# Altium schematic sheet MDBU003_Schematic.SchDoc
size 431 x 279 mm; Date: Not shown in title block; ApprovedBy: Not shown in title block; CheckedBy: Not shown in title block; Author: Not shown in title block; CompanyName: Not shown in title block; Engineer: Not shown in title block; Organization: Not shown in title block; Address1: Not shown in title block; Address2: Not shown in title block; Address3: Not shown in title block; Address4: Not shown in title block; DocumentNumber: 1; Revision: Use project parameter SCH_Rev; SheetNumber: 2; SheetTotal: 2; PageSetup: Record=PageOptions|CenterHorizontal=True|CenterVertical=True|PrintScale=1.00|XCorrection=1.00|YCorrection=1.00|PrintKind=0|BorderSize=5000000|LeftOffset=0|BottomOffset=0|Orientation=2|PaperLength=1000|PaperWidth=1000|Scale=100|PaperSource=15|PrintQuality=600|MediaType=1|DitherType=10|PaperKind=Letter|PrintScaleMode=1; CurrentTime: Not shown in title block; CurrentDate: Not shown in title block; Time: Not shown in title block; DocumentFullPathAndName: Not shown in title block; DocumentName: Not shown in title block; ModifiedDate: Not shown in title block; ImagePath: Not shown in title block
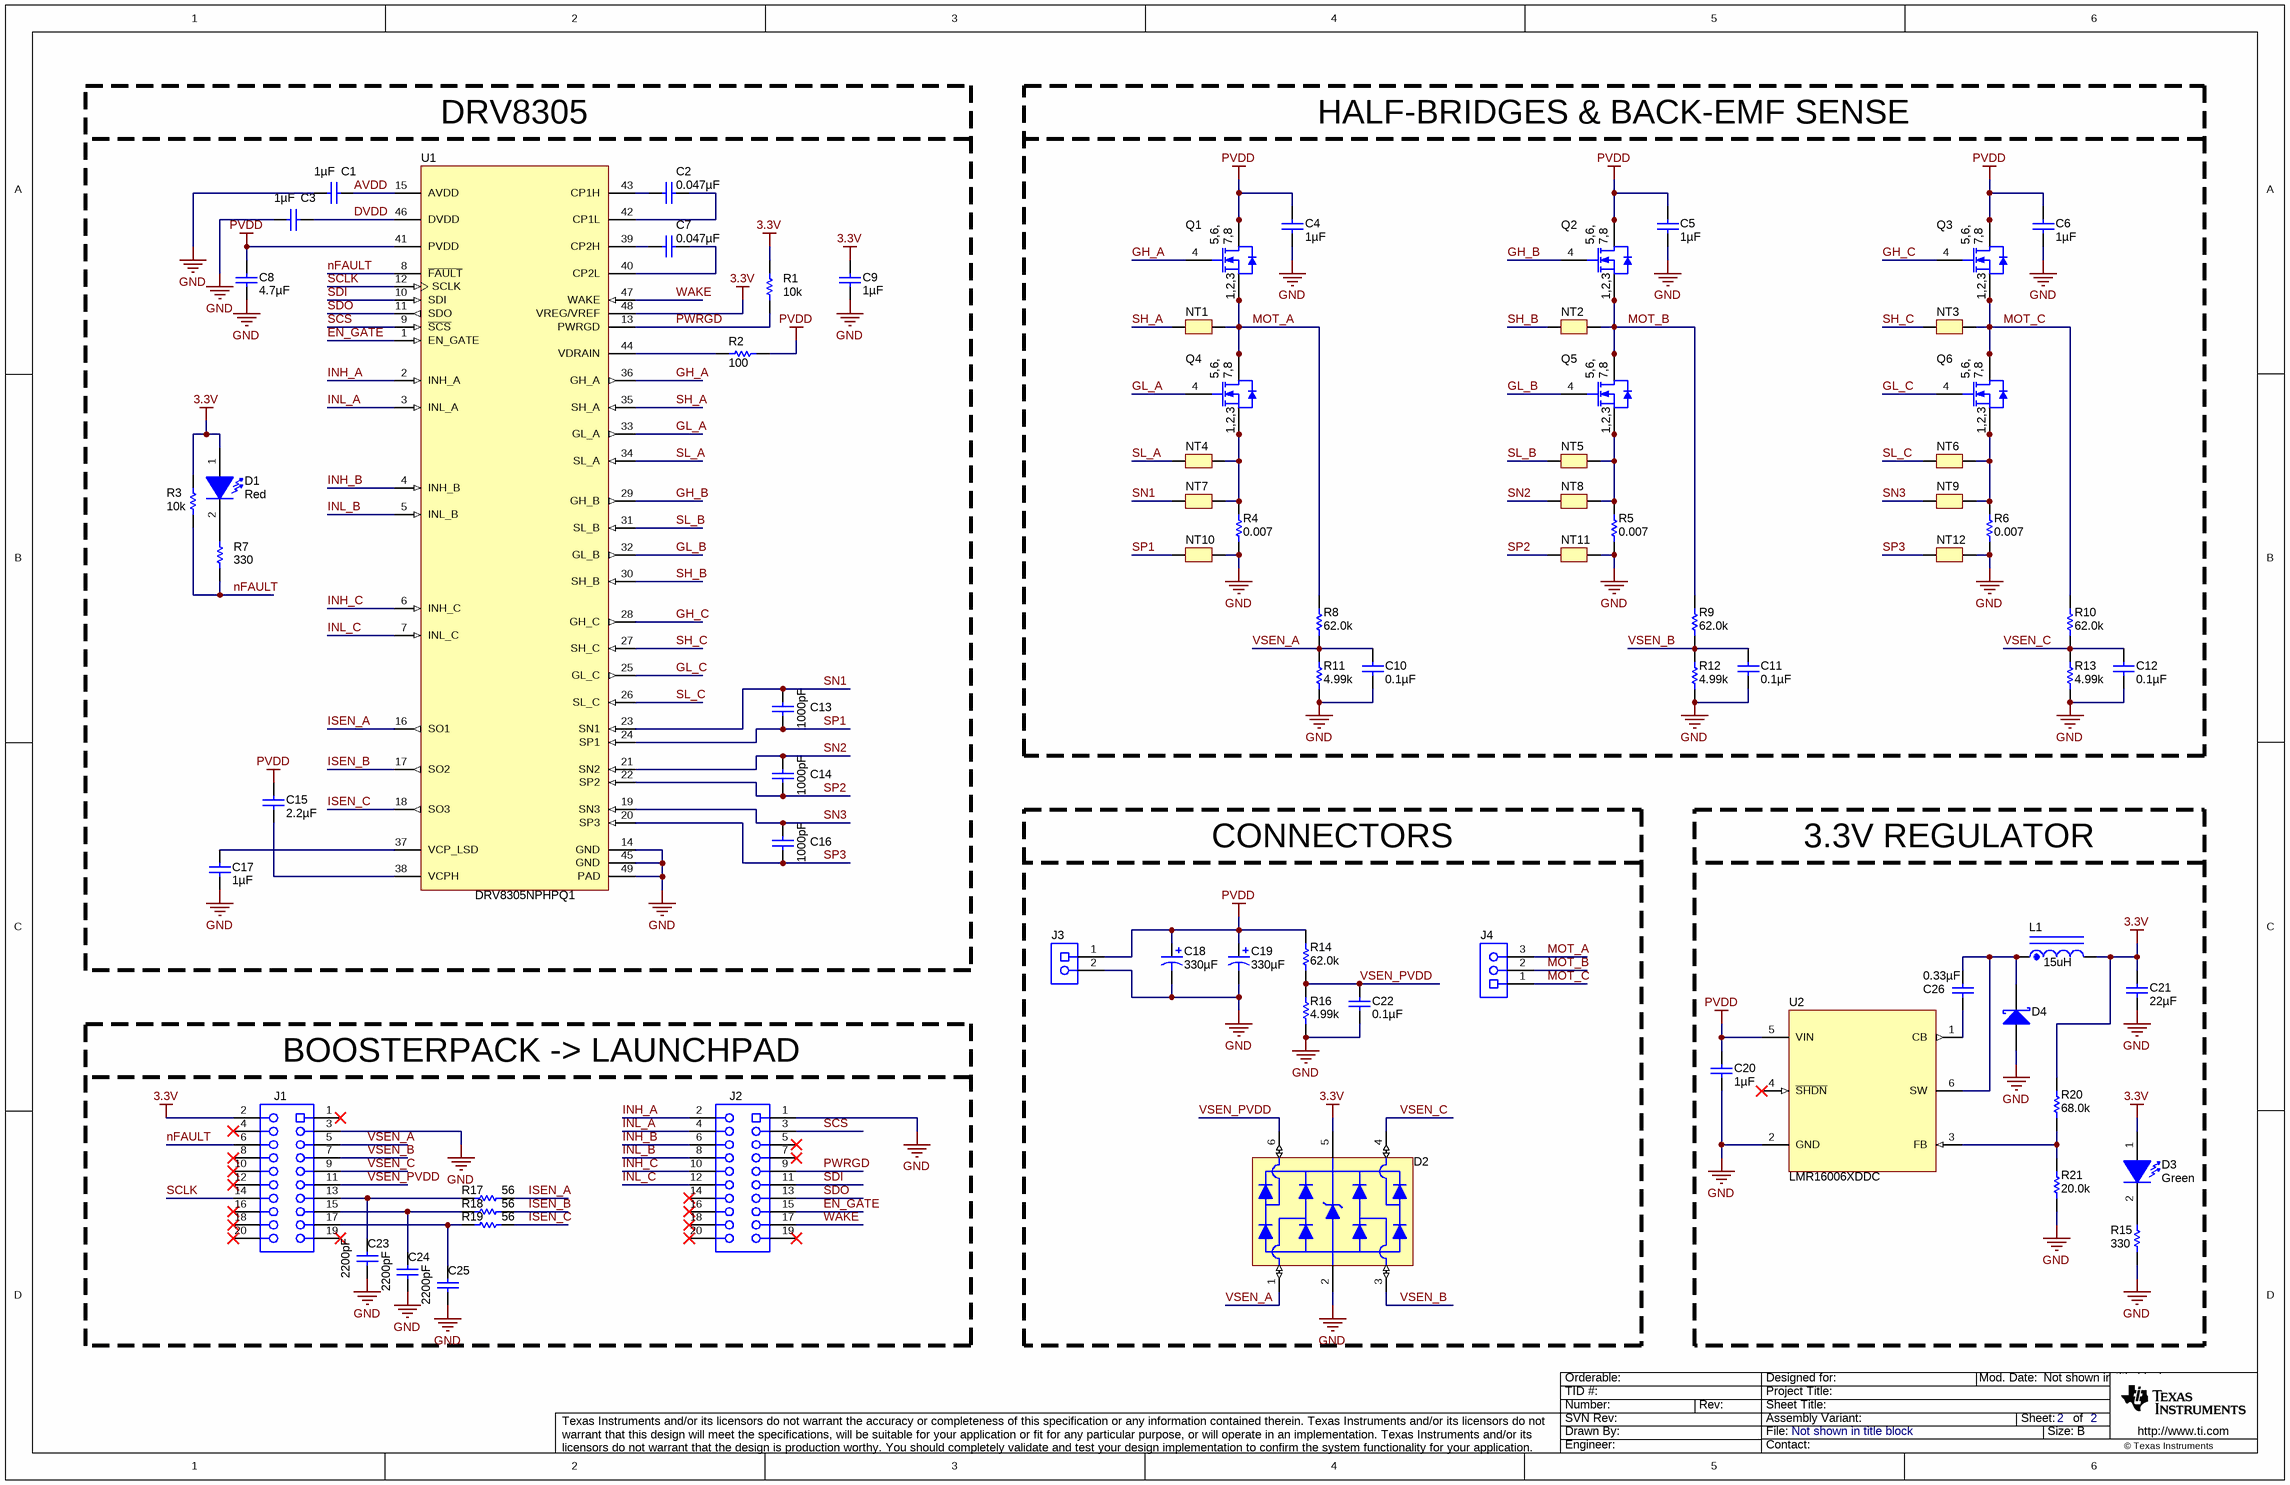
[diagram p0: MDBU003_Schematic.SchDoc]

## Parts
C1  ValueDisplayed: 1µF  [0603L]  (hidden comment: C1608X7R1C105K)
C2  ValueDisplayed: 0.047µF  [0603L]  (hidden comment: C0603C473K1RACTU)
C3  ValueDisplayed: 1µF  [0603L]  (hidden comment: C1608X7R1C105K)
C4  ValueDisplayed: 1µF  [0603L]  (hidden comment: UMK107AB7105KA-T)
C5  ValueDisplayed: 1µF  [0603L]  (hidden comment: UMK107AB7105KA-T)
C6  ValueDisplayed: 1µF  [0603L]  (hidden comment: UMK107AB7105KA-T)
C7  ValueDisplayed: 0.047µF  [0603L]  (hidden comment: C0603C473K1RACTU)
C8  ValueDisplayed: 4.7µF  [1206L]  (hidden comment: GRM31CR71H475KA12L)
C9  ValueDisplayed: 1µF  [0603L]  (hidden comment: C1608X7R1C105K)
C10  ValueDisplayed: 0.1µF  [0603L]  (hidden comment: C0603C104J4RACTU)
C11  ValueDisplayed: 0.1µF  [0603L]  (hidden comment: C0603C104J4RACTU)
C12  ValueDisplayed: 0.1µF  [0603L]  (hidden comment: C0603C104J4RACTU)
C13  ValueDisplayed: 1000pF  [0603L]  (hidden comment: GRM188R71C102KA01D)
C14  ValueDisplayed: 1000pF  [0603L]  (hidden comment: GRM188R71C102KA01D)
C15  ValueDisplayed: 2.2µF  [1210L]  (hidden comment: GRM32ER72A225KA35L)
C16  ValueDisplayed: 1000pF  [0603L]  (hidden comment: GRM188R71C102KA01D)
C17  ValueDisplayed: 1µF  [0603L]  (hidden comment: C1608X7R1C105K)
C18  ValueDisplayed: 330µF  [SM_RADIAL_G]  (hidden comment: EEE-FT1H331AP)
C19  ValueDisplayed: 330µF  [SM_RADIAL_G]  (hidden comment: EEE-FT1H331AP)
C20  ValueDisplayed: 1µF  [0603L]  (hidden comment: UMK107AB7105KA-T)
C21  ValueDisplayed: 22µF  [1206L]  (hidden comment: GRM31CR71A226KE15L)
C22  ValueDisplayed: 0.1µF  [0603L]  (hidden comment: C0603C104J4RACTU)
C23  ValueDisplayed: 2200pF  [0603L]  (hidden comment: GRM188R71C222KA01D)
C24  ValueDisplayed: 2200pF  [0603L]  (hidden comment: GRM188R71C222KA01D)
C25  ValueDisplayed: 2200pF  [0603L]  (hidden comment: GRM188R71C222KA01D)
C26  ValueDisplayed: 0.33µF  [0603L]  (hidden comment: GRM188R71C334KA01D)
D1  value Red  [LED_LTST-C170]  (hidden comment: LTST-C170KRKT)
D2  NUP4201MR6T1G  [TSOP-6]  (value not drawn)
D3  value Green  [LED_LTST-C171]  (hidden comment: LTST-C171GKT)
D4  MBR1H100SFT3G  [SOD-123FL]  (value not drawn)
J1  CRD-081413-A-G  [Major_CRD-081413-A-x]  (value not drawn)
J2  CRD-081413-A-G  [Major_CRD-081413-A-x]  (value not drawn)
J3  691 101 710 002  [Wurth_691101710002]  (value not drawn)
J4  691 101 710 003  [Wurth_691101710003]  (value not drawn)
L1  value 15uH  [SD53]  (hidden comment: SD53-150-R)
NT1  Net-Tie  [Net-Tie_10mil]  (value not drawn)  (net tie, no BOM)
NT2  Net-Tie  [Net-Tie_10mil]  (value not drawn)  (net tie, no BOM)
NT3  Net-Tie  [Net-Tie_10mil]  (value not drawn)  (net tie, no BOM)
NT4  Net-Tie  [Net-Tie_10mil]  (value not drawn)  (net tie, no BOM)
NT5  Net-Tie  [Net-Tie_10mil]  (value not drawn)  (net tie, no BOM)
NT6  Net-Tie  [Net-Tie_10mil]  (value not drawn)  (net tie, no BOM)
NT7  Net-Tie  [Net-Tie_10mil]  (value not drawn)  (net tie, no BOM)
NT8  Net-Tie  [Net-Tie_10mil]  (value not drawn)  (net tie, no BOM)
NT9  Net-Tie  [Net-Tie_10mil]  (value not drawn)  (net tie, no BOM)
NT10  Net-Tie  [Net-Tie_10mil]  (value not drawn)  (net tie, no BOM)
NT11  Net-Tie  [Net-Tie_10mil]  (value not drawn)  (net tie, no BOM)
NT12  Net-Tie  [Net-Tie_10mil]  (value not drawn)  (net tie, no BOM)
Q1  CSD18540Q5B  [TRANS_NexFET_Q5B]  (value not drawn)
Q2  CSD18540Q5B  [TRANS_NexFET_Q5B]  (value not drawn)
Q3  CSD18540Q5B  [TRANS_NexFET_Q5B]  (value not drawn)
Q4  CSD18540Q5B  [TRANS_NexFET_Q5B]  (value not drawn)
Q5  CSD18540Q5B  [TRANS_NexFET_Q5B]  (value not drawn)
Q6  CSD18540Q5B  [TRANS_NexFET_Q5B]  (value not drawn)
R1  value 10k  [0603L]  (hidden comment: CRCW060310K0JNEA)
R2  value 100  [0603L]  (hidden comment: CRCW0603100RJNEA)
R3  value 10k  [0603L]  (hidden comment: CRCW060310K0JNEA)
R4  ValueDisplayed: 0.007  [2512L]  (hidden comment: CRE2512-FZ-R007E-3)
R5  ValueDisplayed: 0.007  [2512L]  (hidden comment: CRE2512-FZ-R007E-3)
R6  ValueDisplayed: 0.007  [2512L]  (hidden comment: CRE2512-FZ-R007E-3)
R7  value 330  [0603L]  (hidden comment: CRCW0603330RJNEA)
R8  ValueDisplayed: 62.0k  [0603L]  (hidden comment: RC0603FR-0762KL)
R9  ValueDisplayed: 62.0k  [0603L]  (hidden comment: RC0603FR-0762KL)
R10  ValueDisplayed: 62.0k  [0603L]  (hidden comment: RC0603FR-0762KL)
R11  ValueDisplayed: 4.99k  [0603L]  (hidden comment: RC0603FR-074K99L)
R12  ValueDisplayed: 4.99k  [0603L]  (hidden comment: RC0603FR-074K99L)
R13  ValueDisplayed: 4.99k  [0603L]  (hidden comment: RC0603FR-074K99L)
R14  ValueDisplayed: 62.0k  [0603L]  (hidden comment: RC0603FR-0762KL)
R15  value 330  [0603L]  (hidden comment: CRCW0603330RJNEA)
R16  ValueDisplayed: 4.99k  [0603L]  (hidden comment: RC0603FR-074K99L)
R17  value 56  [0603L]  (hidden comment: CRCW060356R0JNEA)
R18  value 56  [0603L]  (hidden comment: CRCW060356R0JNEA)
R19  value 56  [0603L]  (hidden comment: CRCW060356R0JNEA)
R20  ValueDisplayed: 68.0k  [0603L]  (hidden comment: RC0603FR-0768KL)
R21  ValueDisplayed: 20.0k  [0603L]  (hidden comment: CRCW060320K0FKEA)
U1  DRV8305NPHPQ1  [PHP0048G_L]
U2  LMR16006XDDC  [DDC0006A_N]

## Blocks framed on the sheet
DRV8305: C1-C3 C7-C9 C13-C17 D1 R1-R3 R7 U1
HALF-BRIDGES & BACK-EMF SENSE: C4-C6 C10-C12 NT1-NT12 Q1-Q6 R4-R6 R8-R13
CONNECTORS: C18 C19 C22 D2 J3 J4 R14 R16
3.3V REGULATOR: C20 C21 C26 D3 D4 L1 R15 R20 R21 U2
BOOSTERPACK -> LAUNCHPAD: C23-C25 J1 J2 R17-R19

## Nets
3.3V: C9.2 C21.1 D1.1(A) D2.5(VP) D3.1(A) J1.2 L1.2 R1.2 R3.2 R20.2 U1.48(VREG/VREF)
GND: C1.1 C3.1 C4.2 C5.2 C6.2 C8.1 C9.1 C10.2 C11.2 C12.2 C17.2 C18.2(-) C19.2(-) C20.2 C21.2 C22.2 C23.2 C24.2 C25.2 D2.2(VN) D4.2(A) J1.3 J2.1 J3.2 NT10.2 NT11.2 NT12.2 R4.1 R5.1 R6.1 R11.1 R12.1 R13.1 R15.1 R16.1 R21.1 U1.14(GND) U1.45(GND) U1.49(PAD) U2.2(GND)
PVDD: C4.1 C5.1 C6.1 C8.2 C15.1 C18.1(+) C19.1(+) C20.1 J3.1 Q1.5(D) Q1.6(D) Q1.7(D) Q1.8(D) Q2.5(D) Q2.6(D) Q2.7(D) Q2.8(D) Q3.5(D) Q3.6(D) Q3.7(D) Q3.8(D) R2.2 R14.2 U1.41(PVDD) U2.5(VIN)
AVDD: C1.2 U1.15(AVDD)
DVDD: C3.2 U1.46(DVDD)
EN_GATE: J2.15 U1.1(EN_GATE)
GH_A: Q1.4(G) U1.36(GH_A)
GH_B: Q2.4(G) U1.29(GH_B)
GH_C: Q3.4(G) U1.28(GH_C)
GL_A: Q4.4(G) U1.33(GL_A)
GL_B: Q5.4(G) U1.32(GL_B)
GL_C: Q6.4(G) U1.25(GL_C)
INH_A: J2.2 U1.2(INH_A)
INH_B: J2.6 U1.4(INH_B)
INH_C: J2.10 U1.6(INH_C)
INL_A: J2.4 U1.3(INL_A)
INL_B: J2.8 U1.5(INL_B)
INL_C: J2.12 U1.7(INL_C)
ISEN_A: R17.2 U1.16(SO1)
ISEN_B: R18.2 U1.17(SO2)
ISEN_C: R19.2 U1.18(SO3)
MOT_A: J4.3 NT1.2 Q1.1(S) Q1.2(S) Q1.3(S) Q4.5(D) Q4.6(D) Q4.7(D) Q4.8(D) R8.2
MOT_B: J4.2 NT2.2 Q2.1(S) Q2.2(S) Q2.3(S) Q5.5(D) Q5.6(D) Q5.7(D) Q5.8(D) R9.2
MOT_C: J4.1 NT3.2 Q3.1(S) Q3.2(S) Q3.3(S) Q6.5(D) Q6.6(D) Q6.7(D) Q6.8(D) R10.2
nFAULT: J1.6 R3.1 R7.1 U1.8(~{FAULT})
PWRGD: J2.9 R1.1 U1.13(PWRGD)
SCLK: J1.14 U1.12(SCLK)
SCS: J2.3 U1.9(~{SCS})
SDI: J2.11 U1.10(SDI)
SDO: J2.13 U1.11(SDO)
SH_A: NT1.1 U1.35(SH_A)
SH_B: NT2.1 U1.30(SH_B)
SH_C: NT3.1 U1.27(SH_C)
SL_A: NT4.1 U1.34(SL_A)
SL_B: NT5.1 U1.31(SL_B)
SL_C: NT6.1 U1.26(SL_C)
SN1: C13.1 NT7.1 U1.23(SN1)
SN2: C14.1 NT8.1 U1.21(SN2)
SN3: C16.1 NT9.1 U1.19(SN3)
SP1: C13.2 NT10.1 U1.24(SP1)
SP2: C14.2 NT11.1 U1.22(SP2)
SP3: C16.2 NT12.1 U1.20(SP3)
VSEN_A: C10.1 D2.1(I/O) J1.5 R8.1 R11.2
VSEN_B: C11.1 D2.3(I/O) J1.7 R9.1 R12.2
VSEN_C: C12.1 D2.4(I/O) J1.9 R10.1 R13.2
VSEN_PVDD: C22.1 D2.6(I/O) J1.11 R14.1 R16.2
WAKE: J2.17 U1.47(WAKE)
NetC2_1: C2.1 U1.43(CP1H)
NetC2_2: C2.2 U1.42(CP1L)
NetC7_1: C7.1 U1.39(CP2H)
NetC7_2: C7.2 U1.40(CP2L)
NetC15_2: C15.2 U1.38(VCPH)
NetC17_1: C17.1 U1.37(VCP_LSD)
NetC23_1: C23.1 J1.13 R17.1
NetC24_1: C24.1 J1.15 R18.1
NetC25_1: C25.1 J1.17 R19.1
NetC26_1: C26.1 D4.1(K) L1.1 U2.6(SW)
NetC26_2: C26.2 U2.1(CB)
NetD1_2: D1.2(K) R7.2
NetD3_2: D3.2(K) R15.2
NetNT4_2: NT4.2 NT7.2 Q4.1(S) Q4.2(S) Q4.3(S) R4.2
NetNT5_2: NT5.2 NT8.2 Q5.1(S) Q5.2(S) Q5.3(S) R5.2
NetNT6_2: NT6.2 NT9.2 Q6.1(S) Q6.2(S) Q6.3(S) R6.2
NetR2_1: R2.1 U1.44(VDRAIN)
NetR20_1: R20.1 R21.2 U2.3(FB)

Not connected (* = marked no-connect by the designer): J1 1* 4* 8* 10* 12* 16* 18* 19* 20*; J2 5* 7* 14* 16* 18* 19* 20*; U2 4(~{SHDN})*

## Notes on the sheet
- Drawn By:
- SVN Rev:
- Number:
- TID #:
- Orderable:
- Rev:
- Sheet Title:
- File:
- Project Title:
- Designed for:
- Assembly Variant:
- Mod. Date:
- Sheet:
- Size:
- of
- B
- http://www.ti.com
- Texas Instruments and/or its licensors do not warrant the accuracy or completeness of this specification or any information contained therein. Texas Instruments and/or its licensors do not warrant that this design will meet the specifications, will be suitable for your application or fit for any particular purpose, or will operate in an implementation. Texas Instruments and/or its licensors do not warrant that the design is production worthy. You should completely validate and test your design implementation to confirm the system functionality for your application.
- Engineer:
- Contact:
- © Texas Instruments
- (in symbol CSD18540Q5B) 5,6,; 7,8; 1,2,3

## Library data of the parts
C1 C3 C9 C17 = C1608X7R1C105K: CAP, CERM, 1 µF, 16 V, +/- 10%, X7R, 0603; Manufacturer: TDK; Polarized: N; CompType: Capacitor; Value: 1uF; U/M: EA; Cap_F: 0.000001; Tolerance_%: 10; ESR_ohm: 0.0057; Value1: 0.0057 ohm; VDC_V: 16; Value2: 16V; TaMin_C: -55; TaMax_C: 125; Cap_Case: 0603; SymbolVersion: 2008-07-09; PartNumber: C1608X7R1C105K; PackageReference: 0603; RoHS: Y; MountType: SMT; Technology: Ceramic; TempCo: X7R; Published: 2008-06-19; Publisher: Texas Instruments; LatestRevisionDate: 2015-02-03; ComponentLink1Description: Datasheet link; ComponentLink1URL: http://www.tdk.co.jp/tefe02/e412_c.pdf; Supplier 1: Digi-Key; Supplier Part Number 1: 445-1604-1-ND; Supplier 2: Farnell; Supplier Part Number 2: 1907343
C2 C7 = GRM188R72A104KA35D: CAP, CERM, 0.047uF, 100V, +/-10%, X7R, 0603; Manufacturer: Kemet; Polarized: N; CompType: Capacitor; U/M: EA; Cap_F: 0.000000047; Tolerance_%: 10; Value1: Unknown; VDC_V: 100; TaMin_C: -55; TaMax_C: 125; Cap_Case: 0603; SymbolVersion: 2008-07-09; Value: 0.047uF; PartNumber: C0603C473K1RACTU; PackageReference: 0603; RoHS: Y; Value2: 100V; MountType: SMT; Technology: Ceramic; TempCo: X7R; Published: 2008-06-19; Publisher: Texas Instruments; LatestRevisionDate: 2013-09-06; ComponentLink1Description: Datasheet link; Supplier 1: Digi-Key; Supplier Part Number 1: 399-9096-1-ND
C4-C6 C20 = UMK107AB7105KA-T: CAP, CERM, 1 µF, 50 V, +/- 10%, X7R, 0603; Manufacturer: Taiyo Yuden; Polarized: N; CompType: Capacitor; Value: 1uF; U/M: EA; Cap_F: 0.000001; Tolerance_%: 10; Value1: Unknown; VDC_V: 50; Value2: 50V; TaMin_C: -55; TaMax_C: 125; Cap_Case: 0603; SymbolVersion: 2008-07-09; PartNumber: UMK107AB7105KA-T; PackageReference: 0603; RoHS: Y; MountType: SMT; Technology: Ceramic; TempCo: X7R; Published: 2008-06-19; Publisher: Texas Instruments; ComponentLink1Description: Datasheet link; ComponentLink1URL: http://www.yuden.co.jp/ut/product/category/capacitor/UMK107AB7105KA-T.pdf; Supplier 1: Digi-Key; Supplier Part Number 1: 587-3247-1-ND; Supplier 2: Mouser; Supplier Part Number 2: 963-UMK107AB7105KA-T; Supplier 3: Newark; Supplier Part Number 3: 45W1781
  C4-C6: LatestRevisionDate: 2015-01-29
  C20: LatestRevisionDate: 2015-02-10
C8 = GRM31CR71H475KA12L: CAP, CERM, 4.7 µF, 50 V, +/- 10%, X7R, 1206; Manufacturer: MuRata; Polarized: N; CompType: Capacitor; Value: 4.7uF; U/M: EA; Cap_F: 0.0000047; Tolerance_%: 10; Value1: Unknown; VDC_V: 50; Value2: 50V; TaMin_C: -55; TaMax_C: 125; Cap_Case: 2220; SymbolVersion: 2008-07-09; PartNumber: GRM31CR71H475KA12L; PackageReference: 1206; RoHS: Y; MountType: SMT; Technology: Ceramic; TempCo: X7R; Published: 2008-06-19; Publisher: Texas Instruments; LatestRevisionDate: 2015-02-03; ComponentLink1Description: Datasheet link; ComponentLink1URL: http://search.murata.co.jp/Ceramy/PnsearchViewAction.do?HnOFG=ON&HnNFG=ON&SEL_CNT=50&sLang=en&sKey=GRM31CR71H475KA12L&x=9&y=9&search=startwith; Supplier 1: Mouser; Supplier Part Number 1: 81-GRM31CR71H475KA2L; Supplier 2: Farnell; Supplier Part Number 2: 1735545; Supplier 3: Newark; Supplier Part Number 3: 24R6347
C10-C12 C22 = C0603C104J4RACTU: CAP, CERM, 0.1 µF, 16 V, +/- 5%, X7R, 0603; Manufacturer: Kemet; Polarized: N; CompType: Capacitor; Value: 0.1uF; U/M: EA; Cap_F: 0.0000001; Tolerance_%: 5; Value1: Unknown; VDC_V: 16; Value2: 16V; TaMin_C: -55; TaMax_C: 125; Cap_Case: 0603; SymbolVersion: 2008-07-09; PartNumber: C0603C104J4RACTU; PackageReference: 0603; RoHS: Y; MountType: SMT; Technology: Ceramic; TempCo: X7R; Published: 2008-06-19; Publisher: Texas Instruments; LatestRevisionDate: 2015-01-29; ComponentLink1Description: Datasheet link; ComponentLink1URL: http://www.kemet.com/kemet/web/homepage/kechome.nsf/vapubfiles/F3102_Y5V.pdf/$file/F3102_Y5V.pdf; Supplier 1: Digi-Key; Supplier Part Number 1: 399-1097-1-ND; Supplier 2: Mouser; Supplier Part Number 2: 80-C0603C104J4R; Supplier 3: Farnell; Supplier Part Number 3: 1650834
C13 C14 C16 = GRM188R71C102KA01D: CAP, CERM, 1000pF, 16V, +/-10%, X7R, 0603; Manufacturer: MuRata; Polarized: N; CompType: Capacitor; U/M: EA; Cap_F: 0.000000001; Tolerance_%: 10; Value1: Unknown; VDC_V: 16; TaMin_C: -55; TaMax_C: 125; Cap_Case: 0603; SymbolVersion: 2008-07-09; Value: 1000pF; PartNumber: GRM188R71C102KA01D; PackageReference: 0603; RoHS: Y; Value2: 16V; MountType: SMT; Technology: Ceramic; TempCo: X7R; Published: 2008-06-19; Publisher: Texas Instruments; LatestRevisionDate: 2014-07-08; ComponentLink1Description: Datasheet link; ComponentLink1URL: http://search.murata.co.jp/Ceramy/PnsearchViewAction.do?HnOFG=ON&HnNFG=ON&SEL_CNT=50&sLang=en&sKey=GRM188R71C102KA01D&x=9&y=9&search=startwith; Supplier 1: Digi-Key; Supplier Part Number 1: GRM188R71C102KA01D-ND; Supplier 2: Mouser; Supplier Part Number 2: 81-GRM188R71C102KA1D
C15 = GRM32ER72A225KA35L: CAP, CERM, 2.2 µF, 100 V, +/- 10%, X7R, 1210; Manufacturer: MuRata; Polarized: N; CompType: Capacitor; Value: 2.2uF; U/M: EA; Cap_F: 0.0000022; Tolerance_%: 10; ESR_ohm: 0.007; Value1: 0.007 ohm; VDC_V: 100; Value2: 100V; IRMS_A: 4.4; TaMin_C: -55; TaMax_C: 125; Cap_Case: 1210; SymbolVersion: 2008-07-09; PartNumber: GRM32ER72A225KA35L; PackageReference: 1210; RoHS: Y; MountType: SMT; Technology: Ceramic; TempCo: X7R; Published: 2008-06-19; Publisher: Texas Instruments; LatestRevisionDate: 2015-02-03; ComponentLink1Description: Datasheet link; ComponentLink1URL: http://search.murata.co.jp/Ceramy/PnsearchViewAction.do?HnOFG=ON&HnNFG=ON&SEL_CNT=50&sLang=en&sKey=GRM32ER72A225KA35L&x=9&y=9&search=startwith; Supplier 1: Digi-Key; Supplier Part Number 1: 490-3385-1-ND; Supplier 2: Mouser; Supplier Part Number 2: 81-GRM32ER72A225KA35; Supplier 3: Farnell; Supplier Part Number 3: 1735547
C18 C19 = EEE-FC1H221P: CAP, AL, 330 µF, 50 V, +/- 20%, 0.3 ohm, SMD; Manufacturer: Panasonic; Polarized: Y; CompType: Capacitor; Value: 330uF; U/M: EA; Cap_F: 0.00033; Tolerance_%: 20; Value1: 0.3 ohm; VDC_V: 50; Value2: 50V; ESR_ohm: 0.3; IRMS_A: 0.5; TaMin_C: -40; TaMax_C: 105; Cap_Case: G; SymbolVersion: 2008-07-09; PartNumber: EEE-FT1H331AP; PackageReference: SMT Radial G; RoHS: Y; MountType: SMT; Technology: AL; Series: FC; Publisher: Texas Instruments; LatestRevisionDate: 2015-02-03; Supplier 1: Digi-Key; Supplier Part Number 1: PCE5026CT-ND
C21 = GRM31CR71A226KE15L: CAP, CERM, 22 µF, 10 V, +/- 10%, X7R, 1206; Manufacturer: MuRata; Polarized: N; CompType: Capacitor; Value: 22uF; U/M: EA; Cap_F: 0.000022; Tolerance_%: 10; Value1: Unknown; Value2: 10V; TaMin_C: -55; TaMax_C: 125; Cap_Case: 1206; SymbolVersion: 2008-07-09; PartNumber: GRM31CR71A226KE15L; PackageReference: 1206; RoHS: Y; VDC_V: 10; MountType: SMT; Technology: Ceramic; TempCo: X7R; Published: 2008-06-19; Publisher: Texas Instruments; LatestRevisionDate: 2015-02-10; ComponentLink1Description: Datasheet link; ComponentLink1URL: http://search.murata.co.jp/Ceramy/PnsearchViewAction.do?HnOFG=ON&HnNFG=ON&SEL_CNT=50&sLang=en&sKey=GRM31CR71A226KE15L&x=9&y=9&search=startwith; Supplier 1: Digi-Key; Supplier Part Number 1: 490-5309-1-ND; Supplier 2: Mouser; Supplier Part Number 2: 81-GRM31CR71A226K15L; Supplier 3: Farnell; Supplier Part Number 3: 1797016
C23-C25 = GRM188R71C222KA01D: CAP, CERM, 2200pF, 16V, +/-10%, X7R, 0603; Manufacturer: MuRata; Polarized: N; CompType: Capacitor; U/M: EA; Cap_F: 0.0000000022; Tolerance_%: 10; Value1: Unknown; VDC_V: 16; TaMin_C: -55; TaMax_C: 125; Cap_Case: 0603; SymbolVersion: 2008-07-09; Value: 2200pF; PartNumber: GRM188R71C222KA01D; PackageReference: 0603; RoHS: Y; Value2: 16V; MountType: SMT; Technology: Ceramic; TempCo: X7R; Published: 2008-06-19; Publisher: Texas Instruments; LatestRevisionDate: 2014-02-11; ComponentLink1Description: Datasheet link; ComponentLink1URL: http://search.murata.co.jp/Ceramy/PnsearchViewAction.do?HnOFG=ON&HnNFG=ON&SEL_CNT=50&sLang=en&sKey=GRM188R71C222KA01D&x=9&y=9&search=startwith; Supplier 1: Digi-Key; Supplier Part Number 1: GRM188R71C222KA01D-ND; Supplier 2: Mouser; Supplier Part Number 2: 81-GRM188R71C222KA1D
C26 = GRM188R71C334KA01D: CAP, CERM, 0.33 µF, 16 V, +/- 10%, X7R, 0603; Manufacturer: MuRata; Polarized: N; CompType: Capacitor; Value: 0.33uF; U/M: EA; Cap_F: 0.00000033; Tolerance_%: 10; Value1: Unknown; VDC_V: 16; Value2: 16V; TaMin_C: -55; TaMax_C: 125; Cap_Case: 0603; SymbolVersion: 2008-07-09; PartNumber: GRM188R71C334KA01D; PackageReference: 0603; RoHS: Y; MountType: SMT; Technology: Ceramic; TempCo: X7R; Published: 2008-06-19; Publisher: Texas Instruments; LatestRevisionDate: 2015-02-10; ComponentLink1Description: Datasheet link; ComponentLink1URL: http://search.murata.co.jp/Ceramy/PnsearchViewAction.do?HnOFG=ON&HnNFG=ON&SEL_CNT=50&sLang=en&sKey=GRM188R71C334KA01D&x=9&y=9&search=startwith; Supplier 1: Digi-Key; Supplier Part Number 1: 490-3294-1-ND; Supplier 2: Mouser; Supplier Part Number 2: 81-GRM188R71C334KA1D; Supplier 3: Farnell; Supplier Part Number 3: 1828892
D1 = LTST-C170KRKT: LED, Red, SMD; Manufacturer: Lite-On; Type: AlInGaP; Vf_V: 2; Value2: 2V; Io_A: 20; Value1: W; U/M: EA; CompType: LED; PartNumber: LTST-C170KRKT; SymbolVersion: 2008-12-08; MountType: SMT; RoHS: Y; PackageReference: LED_0805; Color: red; Published: 2008-07-11; Publisher: Texas Instruments; ComponentLink1URL: http://optoelectronics.liteon.com/en-us/api/DwonloadFileHandler.ashx?txtSpecNo=DS-22-99-0150&txtPartNo=LTST-C170KRKT; ComponentLink1Description: Datasheet link; LatestRevisionDate: 2013-09-07; Supplier 1: Digi-Key; Supplier Part Number 1: 160-1415-1-ND; Supplier 2: Mouser; Supplier Part Number 2: 859-LTST-C170KRKT
D2 = NUP4201MR6T1G: Transient Voltage Suppressors, 5 V, TSOP-6; Manufacturer: ON Semiconductor; SymbolCreator: Altium; Value: 5 V; SymbolVersion: 2015-02-12; PartNumber: NUP4201MR6T1G; CompType: Suppressor; MountType: SMT; ComponentLink1Description: Datasheet Link; ComponentLink1URL: http://www.onsemi.com/pub_link/Collateral/NUP4201MR6-D.PDF; RoHS: Y; PackageReference: TSOP-6; Publisher: Texas Instruments; LatestRevisionDate: 2015-03-09; Supplier 1: Digi-Key; Supplier Part Number 1: NUP4201MR6T1GOSCT-ND; Supplier 2: Mouser; Supplier Part Number 2: 863-NUP4201MR6T1G; Supplier 3: Farnell; Supplier Part Number 3: 2317784
D3 = LTST-C171GKT: LED, Green, SMD; Manufacturer: Lite-On; Type: AlInGaP; Vf_V: 2.1; Value2: 2.1V; Io_A: 20; Value1: W; U/M: EA; CompType: LED; PartNumber: LTST-C171GKT; SymbolVersion: 2008-12-08; MountType: SMT; RoHS: Y; PackageReference: LED_0805; Color: green; Published: 2008-07-11; Publisher: Texas Instruments; ComponentLink1URL: https://sps06.itg.ti.com/sites/KMS/crossdivteams/altium/docs/ComponentDatasheets/LTST-C171GKT.pdf; ComponentLink1Description: Datasheet link; LatestRevisionDate: 2013-09-07; Supplier 1: Digi-Key; Supplier Part Number 1: 160-1423-1-ND; Supplier 2: Mouser; Supplier Part Number 2: 859-LTST-C171GKT
D4 = MBR1H100SFT3G: Diode, Schottky, 100 V, 1 A, SOD-123FL; Manufacturer: ON Semiconductor; U/M: EA; Vf_V: 0.76; Value: 100V; Value1: 1A; Value2: 0.76V; Io_A: 1; Vr_V: 100; TJmax_C: 175; RJC_CperW: 85; CompType: Diode; SymbolVersion: 2008-12-08; PartNumber: MBR1H100SFT3G; PackageReference: SOD-123FL; MountType: SMT; Type: Schottky; RoHS: Y; Published: 2008-06-26; Publisher: Texas Instruments; LatestRevisionDate: 2015-02-10; ComponentLink1Description: Datasheet link; ComponentLink1URL: http://www.onsemi.com/pub_link/Collateral/MBR1H100SF-D.PDF; Supplier 1: Digi-Key; Supplier Part Number 1: MBR1H100SFT3GOSCT-ND; Supplier 2: Mouser; Supplier Part Number 2: 863-MBR1H100SFT3G
J1 J2 = CRD-081413-A-G: Receptacle, 2.54 mm, 10x2, Gold, TH; Manufacturer: Major League Electronics; SymbolCreator: a0412235; U/M: EA; SymbolVersion: 2013-12-20; PartNumber: CRD-081413-A-G; PackageReference: Receptacle, 2.54 mm, 10x2, TH; CompType: Receptacle; RoHS: Y; MountType: TH; ComponentLink1Description: Datasheet Link; ComponentLink1URL: https://sps06.itg.ti.com/sites/KMS/crossdivteams/altium/docs/ComponentDatasheets/081413-A.PDF; Publisher: Texas Instruments; LatestRevisionDate: 2015-02-03
J3 = 691 101 710 002: Terminal Block, 5 mm, 2x1, Tin, TH; Manufacturer: Wurth Elektronik eiSos; SymbolCreator: a0412235; U/M: EA; SymbolVersion: 2013-09-04; PartNumber: 691 101 710 002; PackageReference: Terminal Block, 5 mm, 2x1, TH; CompType: Terminal Block; RoHS: Y; MountType: TH; ComponentLink1Description: Datasheet Link; ComponentLink1URL: http://katalog.we-online.de/em/datasheet/6911017100xx.pdf; Publisher: Texas Instruments; LatestRevisionDate: 2015-02-03; Supplier 1: Digi-Key; Supplier Part Number 1: 732-2026-ND; Supplier 2: Mouser; Supplier Part Number 2: 710-691101710002
J4 = 691 101 710 003: Terminal Block, 5 mm, 3x1, Tin, TH; Manufacturer: Wurth Elektronik eiSos; SymbolCreator: a0412235; U/M: EA; SymbolVersion: 2013-10-03; PartNumber: 691 101 710 003; PackageReference: Terminal Block, 5 mm, 3x1, TH; CompType: Terminal Block; RoHS: Y; MountType: TH; ComponentLink1Description: Datasheet Link; ComponentLink1URL: http://katalog.we-online.de/em/datasheet/6911017100xx.pdf; Publisher: Texas Instruments; LatestRevisionDate: 2015-02-03; Supplier 1: Digi-Key; Supplier Part Number 1: 732-2027-ND; Supplier 2: Mouser; Supplier Part Number 2: 710-691101710003
L1 = SD53-150-R: Inductor, Shielded Drum Core, Ferrite, 15 µH, 1.1 A, 0.122 ohm, SMD; Manufacturer: Cooper Bussman; SymbolCreator: a0412235; Ind_H: 15.0E-6; ValueDisplayed: 15µH; Imax_A: 1.1; Irms: 1.1A @ 40C rise; Isat: 1.1A @ 30% inductance drop; DCR_ohm: 0.122; Value2: 1.1A; SymbolVersion: 2013-02-25; PartNumber: SD53-150-R; CompType: Inductor; Value1: 0.122 ohm; Technology: Shielded Drum Core; MountType: SMT; Material: Ferrite; PackageReference: 5.72x3x5.2mm; Published: 2008-06-26; Publisher: Texas Instruments; LatestRevisionDate: 2015-02-09; ComponentLink1Description: Datasheet link; ComponentLink1URL: http://www.cooperindustries.com/content/dam/public/bussmann/Electronics/Resources/Data%20Sheets/Bus_Elx_DS_PM%204149_SD53_Series.pdf; RoHS: Y; Supplier 1: Digi-Key; Supplier Part Number 1: 513-1458-1-ND; Supplier 2: Mouser; Supplier Part Number 2: 704-SD53-150-R; Supplier 3: Newark; Supplier Part Number 3: 99M5528
NT1-NT12 = Net-Tie: Single point connection between nets.; SymbolCreator: codlsc; SymbolVersion: 2009-07-01; MountType: SMT; PackageReference: N/A; Publisher: Texas Instruments; LatestRevisionDate: 2014-12-30; LatestRevisionNote: Added Alternate PartNumber and Alternate Manufacturer parameters to appropriate components.
Q1-Q6 = CSD18540Q5B: MOSFET, N-CH, 60 V, 28 A, SON 5x6mm; Manufacturer: Texas Instruments; Alternate Manufacturer: None; U/M: EA; ChType: N; Value: 60V; VdsMax_V: 60; Value1: 0.0033 ohm; Rdson45_ohm: 0.0033; Value2: 41 nC; QgTyp_nC: 41; Vgs_V: 20; IdsMax_A: 28; SymbolVersion: 2008-07-09; CompType: MOSFET; PartNumber: CSD18540Q5B; PackageReference: SON 5x6mm; RoHS: Y; MountType: SMT; Published: 2008-06-19; Publisher: Texas Instruments; LatestRevisionDate: 2015-01-27; LatestRevisionNote: Added parts.; ComponentLink1Description: Datasheet link; ComponentLink1URL: http://www.ti.com/lit/ds/symlink/csd18540q5b.pdf
R1 R3 = CRCW060310K0JNEA: RES, 10k ohm, 5%, 0.1W, 0603; Manufacturer: Vishay-Dale; CompType: Resistor; Res_ohm: 10000; Value_Code: 10k0; Tolerance_%: 5; Power_W: 0.1; VDC_V: 75; TempCo: 200 ppm/C; EIA_Code: E24; U/M: EA; SymbolVersion: 2009-05-29; PartNumber: CRCW060310K0JNEA; PackageReference: 0603; RoHS: Y; Value1: 5%; Value2: 0.1W; MountType: SMT; Technology: Thick Film; Published: 2008-06-26; Publisher: Texas Instruments; LatestRevisionDate: 2013-08-23; ComponentLink1Description: Datasheet link; ComponentLink1URL: http://www.vishay.com/docs/20035/dcrcwe3.pdf; Supplier 1: Digi-Key; Supplier Part Number 1: 541-10KGCT-ND; Supplier 2: Farnell; Supplier Part Number 2: 1562240; Supplier 3: Newark; Supplier Part Number 3: 52K8066
R2 = CRCW0603100RJNEA: RES, 100 ohm, 5%, 0.1W, 0603; Manufacturer: Vishay-Dale; CompType: Resistor; Value_Code: 100R; Tolerance_%: 5; Power_W: 0.1; VDC_V: 75; TempCo: 200 ppm/C; EIA_Code: E24; U/M: EA; SymbolVersion: 2009-05-29; PartNumber: CRCW0603100RJNEA; PackageReference: 0603; RoHS: Y; Res_ohm: 100; Value1: 5%; Value2: 0.1W; MountType: SMT; Technology: Thick Film; Published: 2008-06-26; Publisher: Texas Instruments; LatestRevisionDate: 2013-08-23; ComponentLink1Description: Datasheet link; ComponentLink1URL: http://www.vishay.com/docs/20035/dcrcwe3.pdf; Supplier 1: Digi-Key; Supplier Part Number 1: 541-100GCT-ND; Supplier 2: Mouser; Supplier Part Number 2: 71-CRCW0603J-100-E3; Supplier 3: Farnell; Supplier Part Number 3: 1514715
R4-R6 = PMR100HZPFU7L00: RES SMD 0.007 OHM 1% 3W 2512; Manufacturer: Bourns Inc.; CompType: Resistor; Value: 0.007; Value_Code: 7L000; Tolerance_%: 1; Power_W: 3; TempCo: 100 ppm/C; EIA_Code: E96; U/M: EA; SymbolVersion: 2009-05-29; PartNumber: CRE2512-FZ-R007E-3; PackageReference: 2512; RoHS: Y; Res_ohm: 0.007; Value1: 1%; Value2: 3W; MountType: SMT; Technology: Thick Film; Published: 2008-06-26; Publisher: Texas Instruments; LatestRevisionDate: 2014-12-15; ComponentLink1Description: Datasheet link; ComponentLink1URL: http://media.digikey.com/pdf/Data%20Sheets/Rohm%20PDFs/PMR100-SERIES.pdf; Supplier 1: Digi-Key; Supplier Part Number 1: CRE2512-FZ-R007E-3CT-ND
R7 R15 = CRCW0603330RJNEA: RES, 330 ohm, 5%, 0.1W, 0603; Manufacturer: Vishay-Dale; CompType: Resistor; Value_Code: 330R; Tolerance_%: 5; Power_W: 0.1; VDC_V: 75; TempCo: 200 ppm/C; EIA_Code: E24; U/M: EA; SymbolVersion: 2009-05-29; PartNumber: CRCW0603330RJNEA; PackageReference: 0603; RoHS: Y; Res_ohm: 330; Value1: 5%; Value2: 0.1W; MountType: SMT; Technology: Thick Film; Published: 2008-06-26; Publisher: Texas Instruments; LatestRevisionDate: 2013-10-22; ComponentLink1Description: Datasheet link; ComponentLink1URL: http://www.vishay.com/docs/20035/dcrcwe3.pdf; Supplier 1: Digi-Key; Supplier Part Number 1: 541-330GCT-ND; Supplier 2: Mouser; Supplier Part Number 2: 71-CRCW0603J-330-E3; Supplier 3: Farnell; Supplier Part Number 3: 1692522
R8-R10 R14 = RC0603FR-0762KL: RES, 62.0 k, 1%, 0.1 W, 0603; Manufacturer: Yageo America; CompType: Resistor; Value: 62.0k; Res_ohm: 62000; Value_Code: 62k0; Tolerance_%: 1; Power_W: 0.1; Value2: 0.1W; VDC_V: 150; TempCo: 200 ppm/C; U/M: EA; SymbolVersion: 2009-05-29; PartNumber: RC0603FR-0762KL; PackageReference: 0603; RoHS: Y; Value1: 1%; MountType: SMT; Technology: Thick Film; Published: 2008-06-26; Publisher: Texas Instruments; LatestRevisionDate: 2014-12-16; ComponentLink1Description: Datasheet link; ComponentLink1URL: http://www.yageo.com/pdf/Pu-RC0603_51_PbFree_L_2.pdf; Supplier 1: Digi-Key; Supplier Part Number 1: 311-62.0KHRCT-ND; Supplier 2: Mouser; Supplier Part Number 2: 603-RC0603FR-0762KL
R11-R13 R16 = RC0603FR-074K99L: RES, 4.99 k, 1%, 0.1 W, 0603; Manufacturer: Yageo America; CompType: Resistor; Value: 4.99k; Res_ohm: 4990; Value_Code: 4k99; Tolerance_%: 1; Power_W: 0.1; Value2: 0.1W; VDC_V: 150; TempCo: 200 ppm/C; EIA_Code: E96; U/M: EA; SymbolVersion: 2009-05-29; PartNumber: RC0603FR-074K99L; PackageReference: 0603; RoHS: Y; Value1: 1%; MountType: SMT; Technology: Thick Film; Published: 2008-06-26; Publisher: Texas Instruments; LatestRevisionDate: 2014-12-16; ComponentLink1Description: Datasheet link; ComponentLink1URL: http://www.yageo.com/pdf/Pu-RC0603_51_PbFree_L_2.pdf; Supplier 1: Digi-Key; Supplier Part Number 1: 311-4.99KHRCT-ND; Supplier 2: Mouser; Supplier Part Number 2: 603-RC0603FR-074K99L; Supplier 3: Farnell; Supplier Part Number 3: 1799345
R17-R19 = CRCW060356R0JNEA: RES, 56 ohm, 5%, 0.1W, 0603; Manufacturer: Vishay-Dale; CompType: Resistor; Value_Code: 56R0; Tolerance_%: 5; Power_W: 0.1; VDC_V: 75; TempCo: 200 ppm/C; EIA_Code: E24; U/M: EA; SymbolVersion: 2009-05-29; PartNumber: CRCW060356R0JNEA; PackageReference: 0603; RoHS: Y; Res_ohm: 56; Value1: 5%; Value2: 0.1W; MountType: SMT; Technology: Thick Film; Published: 2008-06-26; Publisher: Texas Instruments; LatestRevisionDate: 2014-01-08; ComponentLink1Description: Datasheet link; ComponentLink1URL: http://www.vishay.com/docs/20035/dcrcwe3.pdf; Supplier 1: Digi-Key; Supplier Part Number 1: 541-56GCT-ND; Supplier 2: Mouser; Supplier Part Number 2: 71-CRCW0603J-56-E3; Supplier 3: Farnell; Supplier Part Number 3: 1514781
R20 = RC0603FR-0768KL: RES, 68.0 k, 1%, 0.1 W, 0603; Manufacturer: Yageo America; CompType: Resistor; Value: 68.0k; Res_ohm: 68000; Value_Code: 68k0; Tolerance_%: 1; Power_W: 0.1; Value2: 0.1W; VDC_V: 150; TempCo: 200 ppm/C; U/M: EA; SymbolVersion: 2009-05-29; PartNumber: RC0603FR-0768KL; PackageReference: 0603; RoHS: Y; Value1: 1%; MountType: SMT; Technology: Thick Film; Published: 2008-06-26; Publisher: Texas Instruments; LatestRevisionDate: 2014-12-16; ComponentLink1Description: Datasheet link; ComponentLink1URL: http://www.yageo.com/pdf/Pu-RC0603_51_PbFree_L_2.pdf; Supplier 1: Digi-Key; Supplier Part Number 1: 311-68.0KHRCT-ND; Supplier 2: Mouser; Supplier Part Number 2: 603-RC0603FR-0768KL; Supplier 3: Farnell; Supplier Part Number 3: 9238700
R21 = CRCW060320K0FKEA: RES, 20.0 k, 1%, 0.1 W, 0603; Manufacturer: Vishay-Dale; CompType: Resistor; Value: 20.0k; Res_ohm: 20000; Value_Code: 20k0; Tolerance_%: 1; Power_W: 0.1; Value2: 0.1W; VDC_V: 75; TempCo: 100 ppm/C; EIA_Code: E96; U/M: EA; SymbolVersion: 2009-05-29; PartNumber: CRCW060320K0FKEA; PackageReference: 0603; RoHS: Y; Value1: 1%; MountType: SMT; Technology: Thick Film; Published: 2008-06-26; Publisher: Texas Instruments; LatestRevisionDate: 2014-12-16; ComponentLink1Description: Datasheet link; ComponentLink1URL: http://www.vishay.com/docs/20035/dcrcwe3.pdf; Supplier 1: Digi-Key; Supplier Part Number 1: 541-20.0KHCT-ND; Supplier 2: Mouser; Supplier Part Number 2: 71-CRCW0603-20K-E3; Supplier 3: Farnell; Supplier Part Number 3: 1469774
U1 = DRV83053EPHPRQ1: Three Phase Automotive Gate Driver with Three Integrated Current Shunt Amplifiers and Voltage Regulator, PHP0048G; Alternate PartNumber: DRV83053EPHPQ1; Manufacturer: Texas Instruments; SymbolCreator: Altium; CompType: IC; U/M: EA; SymbolVersion: 2015-02-03; PartNumber: DRV8305NPHPQ1; PackageReference: PHP0048G; MountType: SMT; ComponentLink1Description: Datasheet Link; ComponentLink1URL: https://sps06.itg.ti.com/sites/KMS/crossdivteams/altium/docs/ComponentDatasheets/TI_Q100_3PhPredriver_DRV8305_v9.pdf; Publisher: Texas Instruments; LatestRevisionDate: 2015-02-03; Alternate Manufacturer: Texas Instruments
U2 = LMR16006XDDC: Wide Input Voltage Range Buck Regulator with High Efficiency Sleep Mode, DDC0006A; Manufacturer: Texas Instruments; SymbolCreator: x0208326; CompType: IC; U/M: EA; SymbolVersion: 2013-12-17; PartNumber: LMR16006XDDC; PackageReference: DDC0006A; MountType: SMT; ComponentLink1Description: Datasheet Link; ComponentLink1URL: https://sps06.itg.ti.com/sites/KMS/crossdivteams/altium/docs/ComponentDatasheets/LMR16006.pdf; RoHS: Y; Publisher: Texas Instruments; LatestRevisionDate: 2015-02-10; Alternate Manufacturer: Texas Instruments